# EAGLE design main (EAGLE 7.5.0)
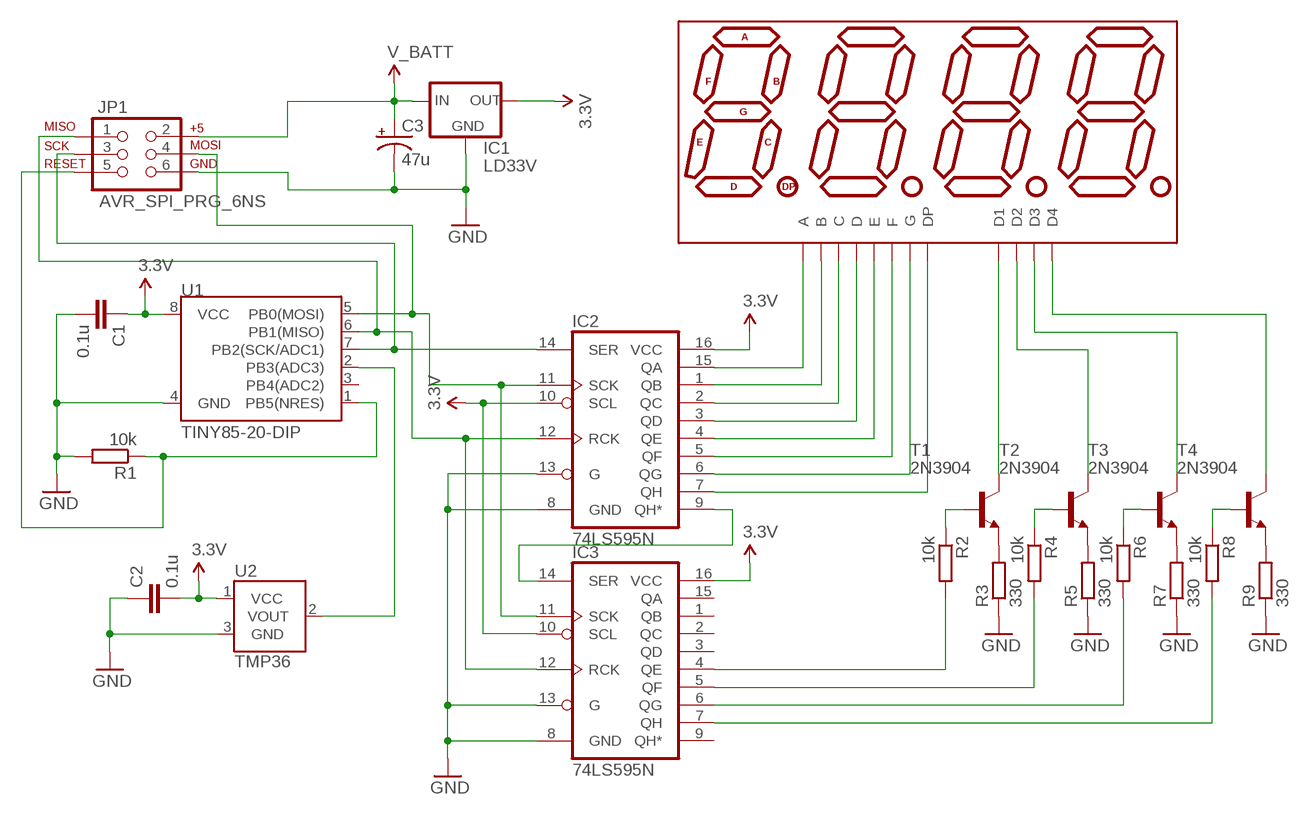
[diagram p0: schematic, sheet 1]

## Parts
C1  0.1u  C-EU025-025X050  [C025-025X050]
C2  0.1u  C-EU025-025X050  [C025-025X050]
C3  47u  CAP_POLPTH2  [CPOL-RADIAL-10UF-25V]
DISP1  7-SEGMENT-4DIGIT-COUNTER-HP-BUBBLE  [DIL12]
IC1  LD33V  78XXL  [78XXL]
IC2  74LS595N  [DIL16]
IC3  74LS595N  [DIL16]
JP1  AVR_SPI_PRG_6NS  [2X3-NS]
R1  10k  R-EU_0204/7  [0204/7]
R2  10k  R-EU_0204/2V  [0204V]
R3  330  R-EU_0204/2V  [0204V]
R4  10k  R-EU_0204/2V  [0204V]
R5  330  R-EU_0204/2V  [0204V]
R6  10k  R-EU_0204/2V  [0204V]
R7  330  R-EU_0204/2V  [0204V]
R8  10k  R-EU_0204/2V  [0204V]
R9  330  R-EU_0204/2V  [0204V]
T1  2N3904  [TO92]
T2  2N3904  [TO92]
T3  2N3904  [TO92]
T4  2N3904  [TO92]
U1  TINY85-20-DIP  ATTINY45TINY85-20-DIP  [DIP08]
U2  TMP36  TMP36GT9  [TO-92]

## Nets
GND: C1.2 C2.1 C3.2(-) IC1.GND IC2.8(GND) IC2.13(G) IC3.8(GND) IC3.13(G) JP1.6 R1.2 R3.1 R5.1 R7.1 R9.1 U1.4(GND) U2.3(GND)
N$1: DISP1.12(A) IC2.15(QA)
N$2: DISP1.11(B) IC2.1(QB)
N$3: DISP1.3(C) IC2.2(QC)
N$4: DISP1.8(D) IC2.3(QD)
N$5: DISP1.2(E) IC2.4(QE)
N$6: DISP1.9(F) IC2.5(QF)
N$7: DISP1.7(G) IC2.6(QG)
N$8: DISP1.5(DP) IC2.7(QH)
N$9: IC2.9(QH*) IC3.14(SER)
N$11: IC2.11(SCK) IC3.11(SCK) JP1.4 U1.5(PB0(MOSI))
N$13: IC2.12(RCK) IC3.12(RCK) JP1.1 U1.6(PB1(MISO))
N$14: R3.2 T1.3(E)
N$15: R5.2 T2.3(E)
N$16: R9.2 T4.3(E)
N$17: R7.2 T3.3(E)
N$18: IC3.7(QH) R8.2
N$19: IC3.6(QG) R6.2
N$20: IC3.5(QF) R4.2
N$21: IC3.4(QE) R2.2
N$22: R2.1 T1.2(B)
N$23: R4.1 T2.2(B)
N$24: R6.1 T3.2(B)
N$25: R8.1 T4.2(B)
N$26: DISP1.1(D1) T1.1(C)
N$27: DISP1.6(D4) T4.1(C)
N$28: DISP1.4(D3) T3.1(C)
N$29: DISP1.10(D2) T2.1(C)
N$30: U1.2(PB3(ADC3)) U2.2(VOUT)
N$31: JP1.5 R1.1 U1.1(PB5(NRES))
N$32: IC2.14(SER) JP1.3 U1.7(PB2(SCK/ADC1))
V_BATT: C3.1(+) IC1.IN JP1.2
VCC: C1.1 C2.2 IC1.OUT IC2.10(SCL) IC2.16(VCC) IC3.10(SCL) IC3.16(VCC) U1.8(VCC) U2.1(VCC) ; supply symbol labelled 3.3V
Unconnected: IC3.1(QB) IC3.2(QC) IC3.3(QD) IC3.9(QH*) IC3.15(QA) U1.3(PB4(ADC2))

## Library data of the parts
C1 C2 = rcl:C-EU: CAPACITOR, European symbol
C3 = SparkFun-Capacitors:CAP_POL: Capacitor Polarized These are standard SMD and PTH capacitors. Normally 10uF, 47uF, and 100uF in electrolytic and tantalum varieties. Always verify the external diameter of the through hole cap, it varies with capacity, voltage, and manufacturer. The EIA devices should be standard.
DISP1 = SparkFun-Displays:7-SEGMENT-4DIGIT-COUNTER; STOREFRONT: COM-12710
IC1 = v-reg:78XXL: VOLTAGE REGULATOR
IC2 IC3 = SparkFun-DigitalIC:74*595: 8-bit SHIFT REGISTER, output latch
JP1 = SparkFun-Connectors:AVR_SPI_PRG_6: AVR ISP 6 Pin This is the reduced ISP connector for AVR programming. Common on Arduino. This footprint will take up less PCB space and can be used with a 10-pin to 6-pin adapter such as SKU: BOB-08508 **Special note about "TEST_POINT" package. The stop mask is on the top side, so if you want your programming test points to be on the bottom of your board, make sure to place this package on the bottom side of the board. This also ensure that the orientation to program from the bottom side will be correct.
R1-R9 = rcl:R-EU_: RESISTOR, European symbol
T1-T4 = transistor:2N3904: NPN TRANSISTOR
U1 = SparkFun-DigitalIC:ATTINY45: Atmel 8-pin 2/4/8kB flash uC; PROD_ID: IC-09445
U2 = SparkFun-Sensors:TMP36: Precision degC temp sensor, analog out

## Board
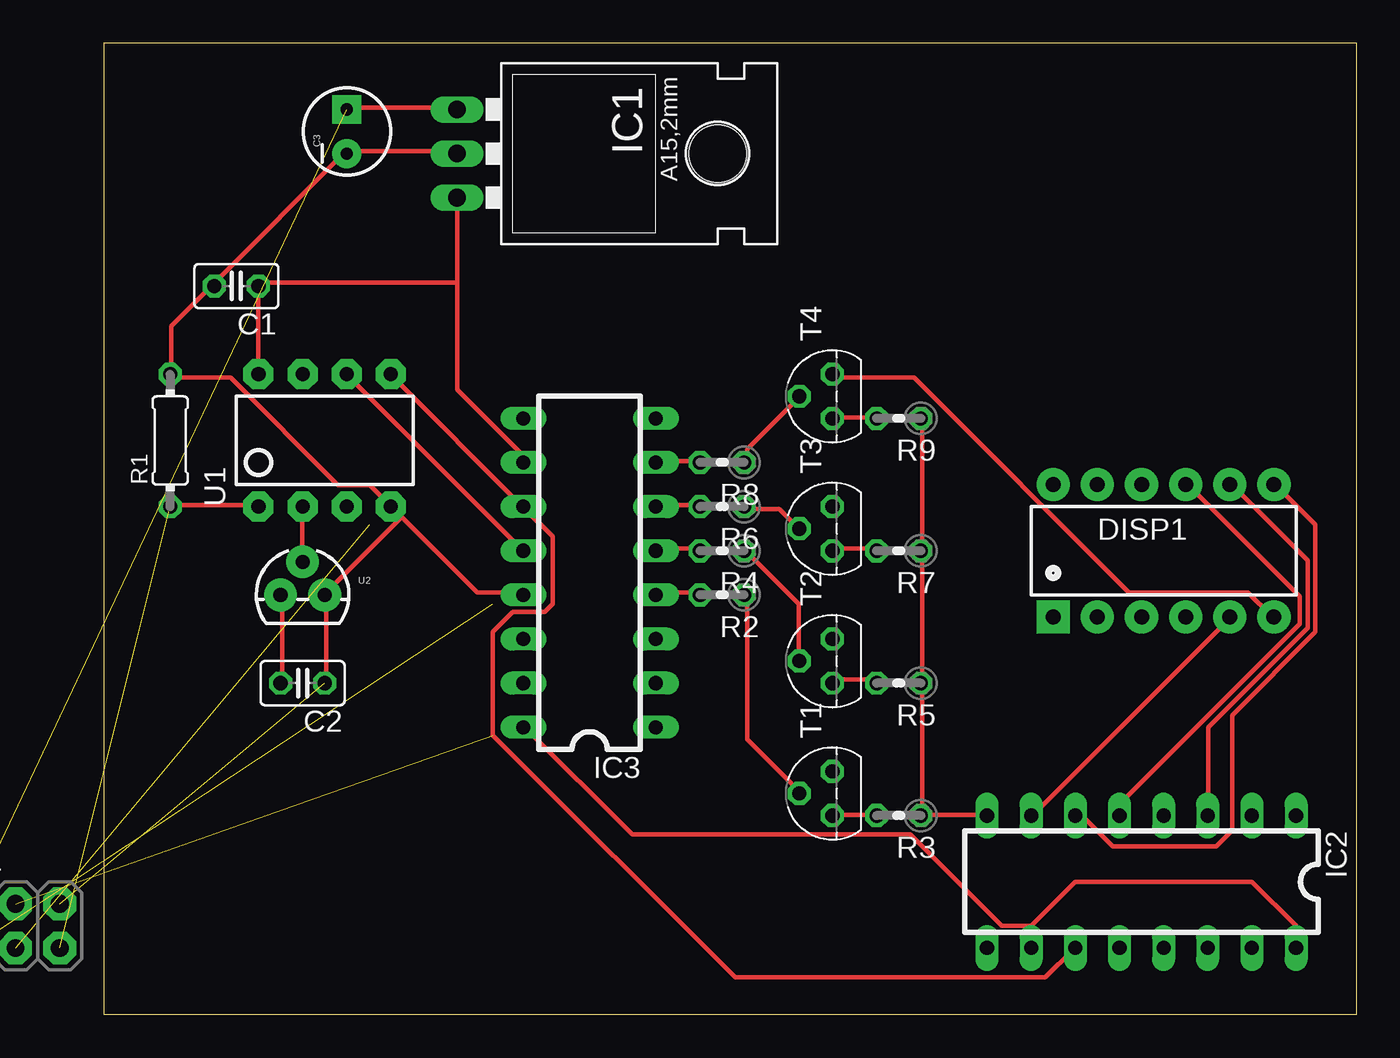
[diagram p1: board, top side]
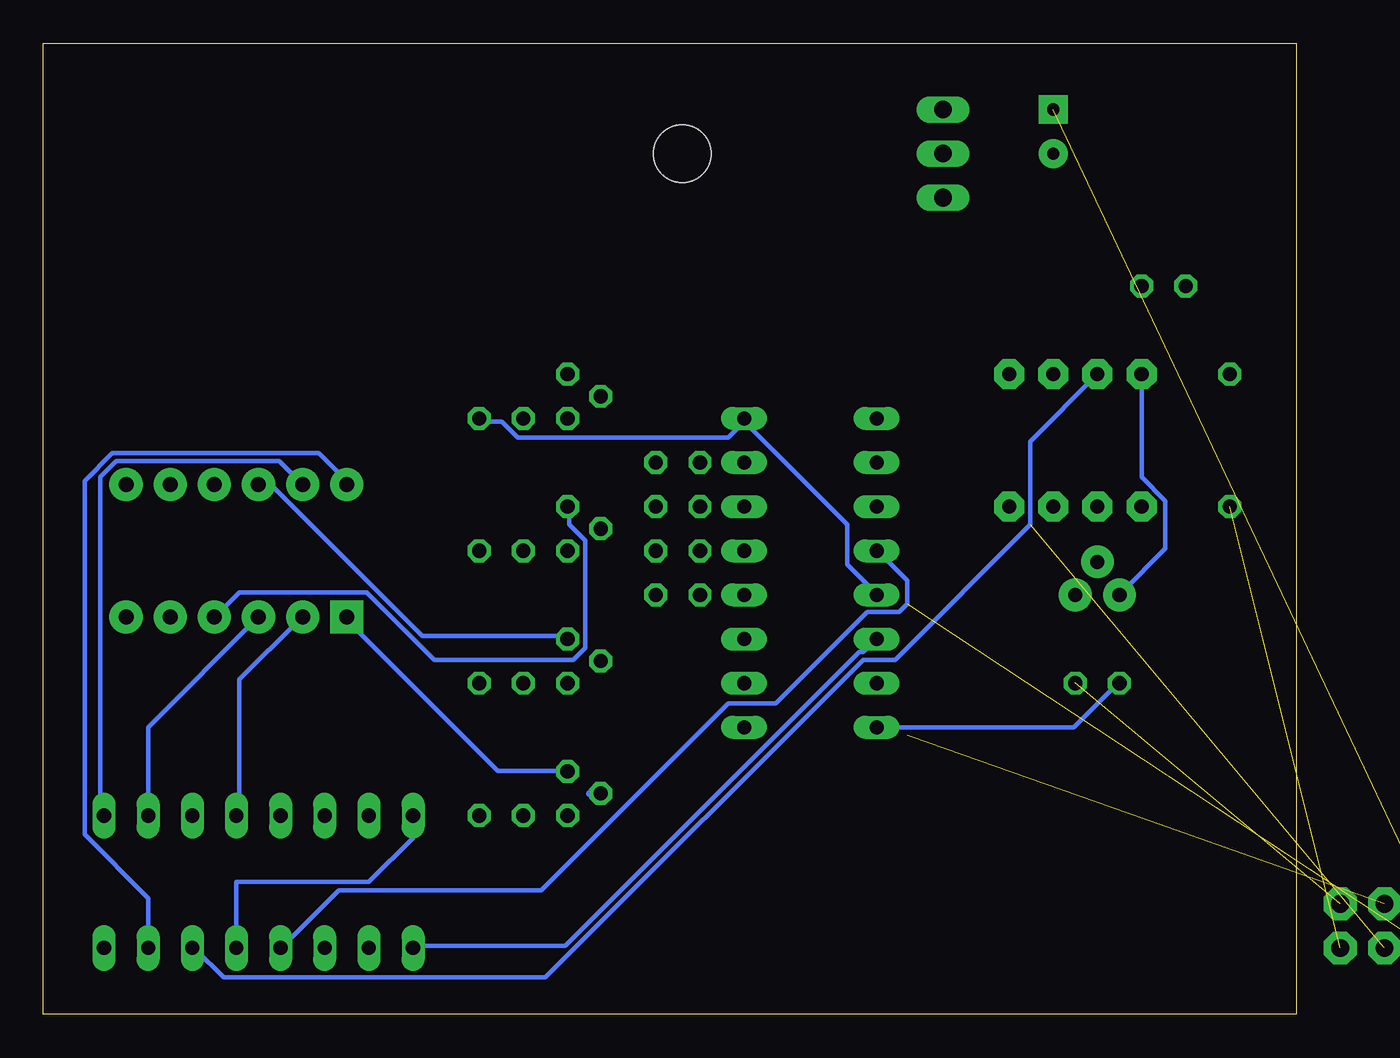
[diagram p2: board, bottom side, seen from below]

Size 72.06 x 55.87 mm. Coordinates in mm from the lower left corner, seen from the top.
Outline: 0,0 72.06,0 72.06,55.87 0,55.87 0,0
Copper layers (1*16): Top 0.035mm / dielectric 1.5mm / Bottom 0.035mm
Design rules "default": minimum track width 10mil, minimum drill 24mil, track to track 8mil, track to pad 8mil, pad to pad 8mil, via to via 8mil, smd to smd 8mil, copper to edge 40mil, drill to drill 8mil, minimum pad ring 10mil, minimum via ring 8mil, stop-mask expansion 4mil, vias tented up to drill 0mil, thermal gap 10mil

### Footprints (pad centres in the part's own frame; a part is rotated, then mirrored left to right if it is on the bottom)
C025-025X050 = drill 0.813 octagon: 1 -1.27,0; 2 1.27,0
CPOL-RADIAL-10UF-25V = drill 0.7 pad 1.651 square: 1 1.27,0 | drill 0.7 pad 1.651: 2 -1.27,0
DIL12 = drill 0.864 pad 1.905 square: 1 -6.35,-3.81 | drill 0.864 pad 1.905: 2 -3.81,-3.81; 3 -1.27,-3.81; 4 1.27,-3.81; 5 3.81,-3.81; 6 6.35,-3.81; 7 6.35,3.81; 8 3.81,3.81; 9 1.27,3.81; 10 -1.27,3.81; 11 -3.81,3.81; 12 -6.35,3.81
78XXL = drill 1.016 long: GND 0,-3.81; IN -2.54,-3.81; OUT 2.54,-3.81 | hole 3.302: 0,11.176
DIL16 = drill 0.813 long: 1 -8.89,-3.81; 2 -6.35,-3.81; 3 -3.81,-3.81; 4 -1.27,-3.81; 5 1.27,-3.81; 6 3.81,-3.81; 7 6.35,-3.81; 8 8.89,-3.81; 9 8.89,3.81; 10 6.35,3.81; 11 3.81,3.81; 12 1.27,3.81; 13 -1.27,3.81; 14 -3.81,3.81; 15 -6.35,3.81; 16 -8.89,3.81
2X3-NS = drill 1.016 pad 1.88 square: 1 -2.54,-1.27 | drill 1.016 pad 1.88 octagon: 2 -2.54,1.27; 3 0,-1.27; 4 0,1.27; 5 2.54,-1.27; 6 2.54,1.27
0204/7 = drill 0.813 octagon: 1 -3.81,0; 2 3.81,0
0204V = drill 0.813 octagon: 1 -1.27,0; 2 1.27,0
TO92 = drill 0.813 octagon: 1 1.27,0; 2 0,1.905; 3 -1.27,0
DIP08 = drill 0.813 pad 1.727 octagon: 1 -3.81,-3.81; 2 -1.27,-3.81; 3 1.27,-3.81; 4 3.81,-3.81; 5 3.81,3.81; 6 1.27,3.81; 7 -1.27,3.81; 8 -3.81,3.81
TO-92 = drill 0.813 pad 1.88: 1 -1.27,0; 2 0,1.905; 3 1.27,0

### Placement (x,y rotation side)
C1  7.62,41.91 180 top
C2  11.43,19.05 180 top
C3  13.97,50.8 90 top
DISP1  60.96,26.67 0 top
IC1  24.13,49.53 270 top
IC2  59.69,7.62 180 top
IC3  27.94,25.4 90 top
JP1  -5.08,5.08 0 top
R1  3.81,33.02 90 top
R2  35.56,24.13 180 top
R3  45.72,11.43 180 top
R4  35.56,26.67 180 top
R5  45.72,19.05 180 top
R6  35.56,29.21 180 top
R7  45.72,26.67 180 top
R8  35.56,31.75 180 top
R9  45.72,34.29 180 top
T1  41.91,12.7 90 top
T2  41.91,20.32 90 top
T3  41.91,27.94 90 top
T4  41.91,35.56 90 top
U1  12.7,33.02 0 top
U2  11.43,24.13 0 top

### Tracks (layer width: path | path; a pad name or v marks a point on that pad's centre or on a via)
GND  (1 unrouted)
  Top 0.254: 6.38,41.88 C1.2 | C1.2 6.15,41.88 3.86,39.6 3.86,36.85 R1.2 3.86,36.63 7.29,36.63 13.46,30.45 15.29,30.45 16.43,29.31 U1.4 | IC1.GND 20.32,49.66 14.15,49.66 C3.2 13.92,49.66 6.38,42.11 C1.2 | 47.07,11.48 50.72,11.48 IC2.8 | R9.1 47.07,34.11 47.07,26.8 R7.1 47.07,26.57 47.07,19.25 R5.1 47.07,19.02 47.07,11.48 | 47.07,11.48 R3.1 | C2.1 12.78,19.25 12.78,24.05 U2.3 12.78,24.28 17.12,28.63 | 17.12,28.63 16.66,29.08 U1.4 | 17.12,28.63 21.46,24.28 23.98,24.28 IC3.13 | 17.12,28.63 U1.4
  Bottom 0.254: IC2.13 60.96,7.62 53.34,7.62 50.8,10.16 IC2.8 | 31.75,34.11 25.81,28.17 25.81,25.88 24.21,24.28 IC3.13 | 31.75,34.11 32.66,33.2 44.78,33.2 45.7,34.11 46.84,34.11 R9.1 | 31.75,34.11 IC3.8
N$1
  Bottom 0.254: IC2.15 66.04,6.68 69.7,10.34 69.7,30.68 68.1,32.28 56.21,32.28 54.61,30.68 DISP1.12
N$2
  Bottom 0.254: DISP1.11 58.5,31.83 67.87,31.83 68.78,30.91 68.78,11.48 IC2.1
N$3
  Bottom 0.254: IC2.2 66.04,16.51 DISP1.3
N$4
  Top 0.254: IC2.3 63.52,11.48 63.52,16.51 69.24,22.23 69.24,26.11 64.9,30.45 DISP1.8
  Bottom 0.254: 64.9,30.68 DISP1.8
N$5
  Bottom 0.254: IC2.4 60.78,11.48 60.78,19.25 57.35,22.68 DISP1.2
N$6
  Top 0.254: IC2.5 58.5,11.48 58.5,12.17 68.78,22.45 68.78,24.05 62.38,30.45 DISP1.9
N$7
  Top 0.254: IC2.6 55.98,11.25 56.44,11.25 58.04,9.65 63.98,9.65 64.9,10.57 64.9,17.2 69.7,22 69.7,28.17 67.41,30.45 DISP1.7
  Bottom 0.254: 55.98,11.48 IC2.6
N$8
  Top 0.254: IC2.7 53.47,11.48 64.67,22.68 DISP1.5
N$9
  Bottom 0.254: IC3.14 24.21,21.54 24.89,20.85 25.12,20.85 42.04,3.94 50.72,3.94 IC2.9
N$11  (1 unrouted)
  Top 0.254: IC2.11 55.75,3.71 54.15,2.11 36.32,2.11 22.38,16.05 22.38,22 23.52,23.14 25.35,23.14 25.81,23.6 25.81,27.48 24.21,29.08 IC3.11 23.98,29.31 16.66,36.63 U1.5
N$13  (1 unrouted)
  Top 0.254: U1.6 14.15,36.63 23.98,26.8 IC3.12
  Bottom 0.254: IC2.12 58.27,3.94 55.07,7.14 43.41,7.14 32.66,17.88 29.92,17.88 24.66,23.14 22.84,23.14 22.38,23.6 22.38,24.97 23.98,26.57 IC3.12
N$14
  Top 0.254: T1.3 42.04,11.48 44.32,11.48 R3.2
N$15
  Top 0.254: T2.3 42.04,19.25 44.32,19.25 R5.2
N$16
  Top 0.254: T4.3 42.04,34.34 44.32,34.34 R9.2
N$17
  Top 0.254: T3.3 42.04,26.8 44.32,26.8 R7.2
N$18
  Top 0.254: IC3.7 31.75,31.83 34.27,31.83 R8.2
N$19
  Top 0.254: IC3.6 31.75,29.31 34.27,29.31 R6.2
N$20
  Top 0.254: IC3.5 31.75,26.8 34.27,26.8 R4.2
N$21
  Top 0.254: IC3.4 31.75,24.28 34.27,24.28 R2.2
N$22
  Top 0.254: R2.1 37.01,24.05 37.01,15.82 39.98,12.85 T1.2
  Bottom 0.406: 40.64,12.7 T1.2
N$23
  Top 0.254: T2.2 39.98,20.4 39.98,23.6 37.01,26.57 R4.1
N$24
  Top 0.254: R6.1 37.01,29.08 38.84,29.08 39.98,27.94 T3.2
N$25
  Top 0.254: R8.1 37.01,31.83 37.01,32.51 39.98,35.48 T4.2
N$26
  Bottom 0.254: T1.1 42.04,13.99 45.92,13.99 54.61,22.68 DISP1.1
N$27
  Top 0.254: T4.1 42.04,36.63 46.61,36.63 58.95,24.28 65.81,24.28 67.18,22.91 DISP1.6
N$28
  Bottom 0.254: T3.1 41.81,29.08 41.81,28.17 40.89,27.25 40.89,21.08 41.58,20.4 49.58,20.4 53.47,24.28 60.78,24.28 62.15,22.91 DISP1.4
N$29
  Bottom 0.254: T2.1 42.04,21.77 50.27,21.77 58.95,30.45 59.64,30.45 DISP1.10
N$30
  Top 0.254: U1.2 11.4,29.08 11.4,26.11 U2.2
N$31  (1 unrouted)
  Top 0.254: R1.1 3.86,29.31 8.89,29.31 U1.1
N$32  (1 unrouted)
  Bottom 0.254: U1.7 15.29,32.97 15.29,28.17 23.06,20.4 24.89,20.4 43.18,2.11 61.7,2.11 63.3,3.71 IC2.14
V_BATT  (1 unrouted)
  Top 0.254: IC1.IN 20.32,52.17 14.15,52.17 C3.1
VCC
  Top 0.254: IC2.16 68.58,5.08 66.04,7.62 55.88,7.62 53.34,5.08 IC2.10 53.24,5.08 51.64,5.08 46.38,10.34 30.38,10.34 24.21,16.51 IC3.16 | U1.8 C1.1 8.89,42.11 20.32,42.11 | IC1.OUT 20.32,42.11 | 20.32,42.11 20.32,35.94 23.98,32.28 23.98,31.83 IC3.10 | C2.2 10.26,19.25 10.26,24.05 U2.1
  Bottom 0.254: IC3.16 12.78,16.51 10.26,19.02 C2.2 | U1.8 8.89,30.91 7.52,29.54 7.52,26.8 10.03,24.28 U2.1